# EAGLE design Sensor Board (EAGLE 9.1.1)
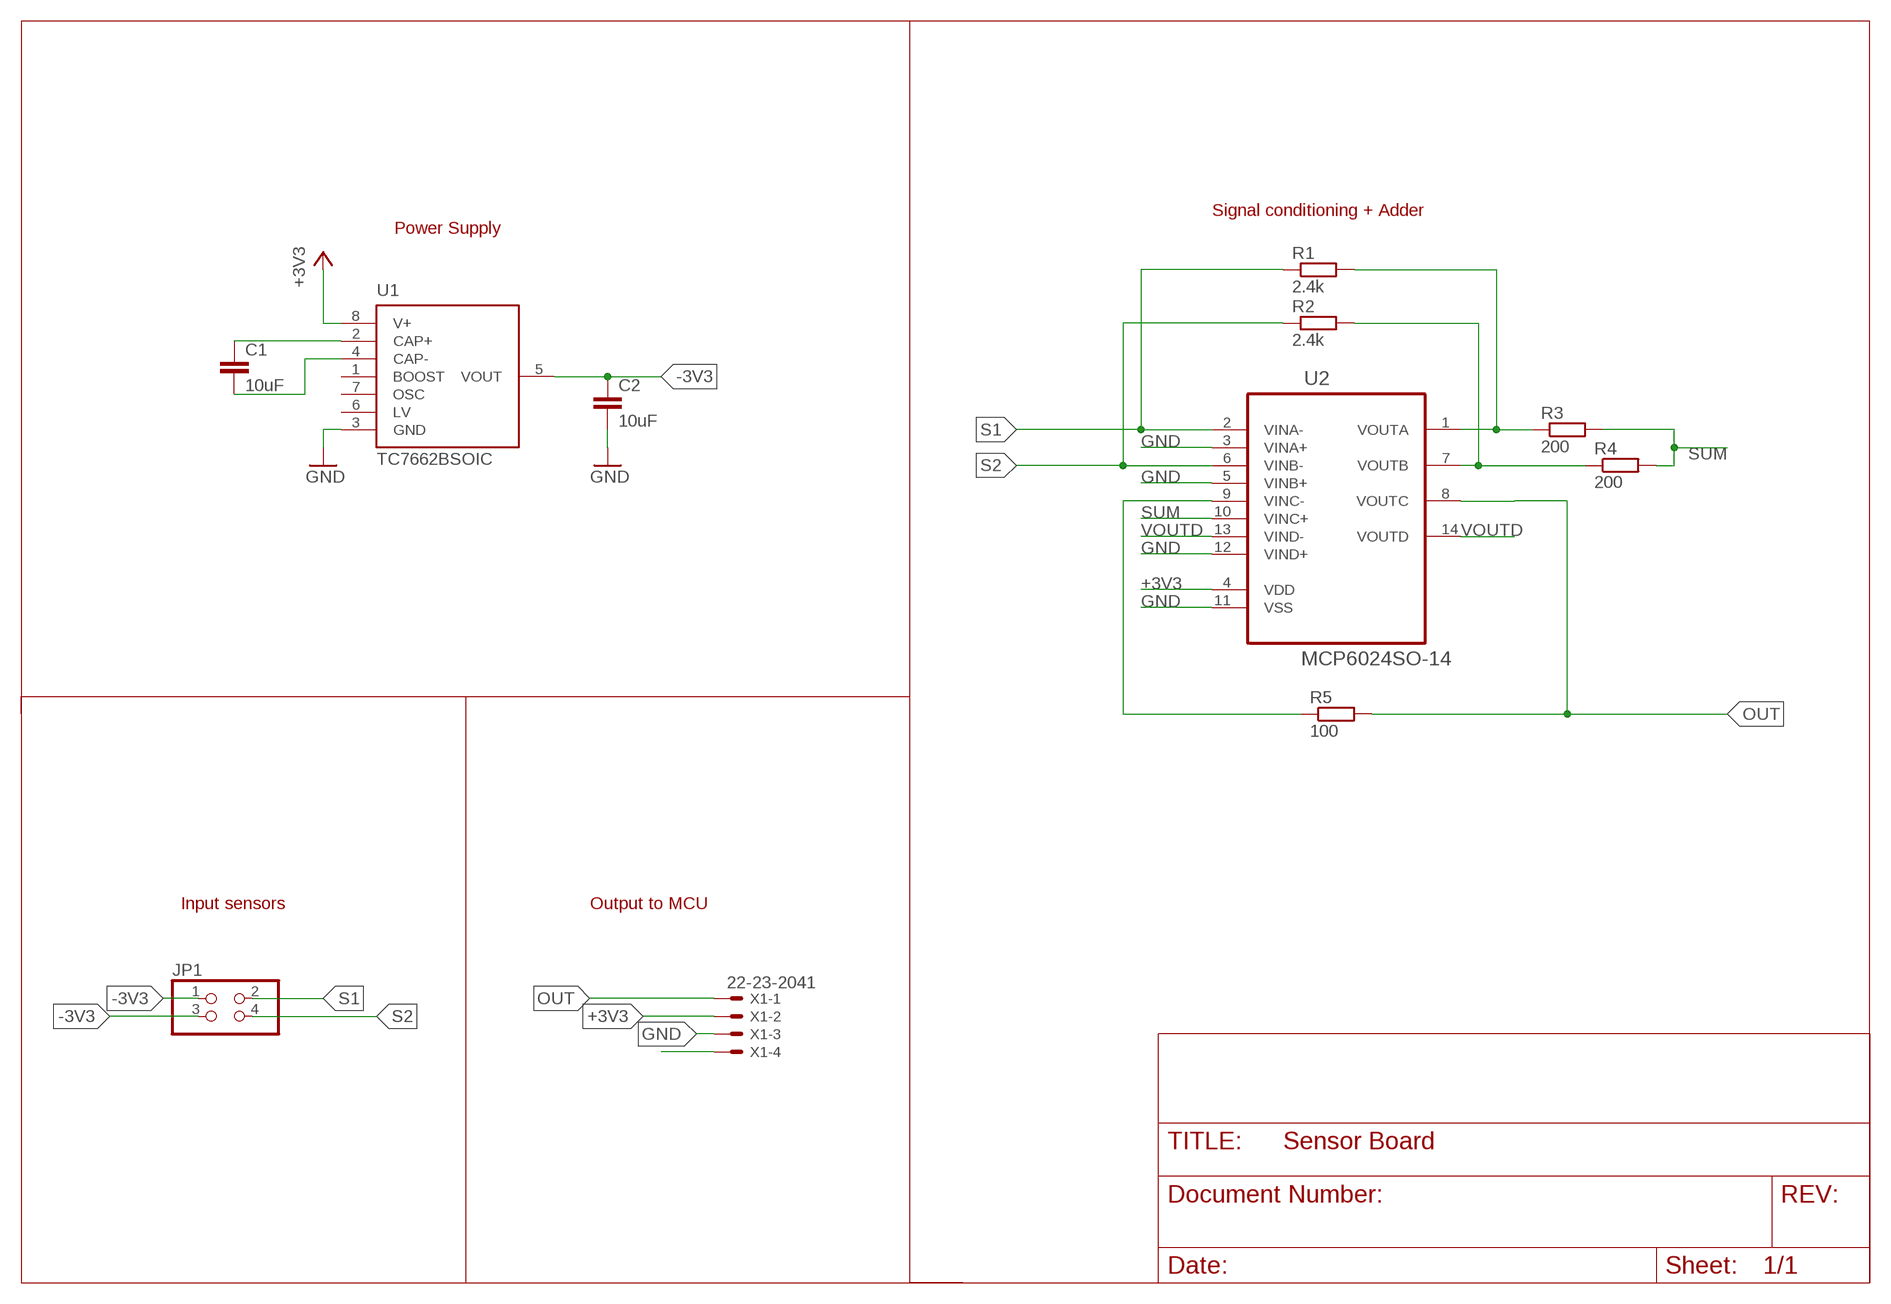
[diagram p0: schematic, sheet 1]

## Parts
C1  10uF  C-EUC0603  [C0603]
C2  10uF  C-EUC0603  [C0603]
JP1  PINHD-2X2/90  [2X02/90]
R1  2.4k  R-EU_R0603  [R0603]
R2  2.4k  R-EU_R0603  [R0603]
R3  200  R-EU_R0603  [R0603]
R4  200  R-EU_R0603  [R0603]
R5  100  R-EU_R0603  [R0603]
U1  TC7662BSOIC  [SO-08]
U2  MCP6024SO-14  [SO-14]
X1  22-23-2041  [22-23-2041]

## Nets
+3V3: U1.8(V+) U2.4(VDD) X1.2
-3V3: C2.1 JP1.1 JP1.3 U1.5(VOUT)
GND: C2.2 U1.3(GND) U2.3(VINA+) U2.5(VINB+) U2.11(VSS) U2.12(VIND+) X1.3
N$1: C1.1 U1.2(CAP+)
N$2: C1.2 U1.4(CAP-)
N$5: R1.2 R3.1 U2.1(VOUTA)
N$7: R2.2 R4.1 U2.7(VOUTB)
N$8: R5.1 U2.9(VINC-)
N$9: X1.4
OUT: R5.2 U2.8(VOUTC) X1.1
S1: JP1.2 R1.1 U2.2(VINA-)
S2: JP1.4 R2.1 U2.6(VINB-)
SUM: R3.2 R4.2 U2.10(VINC+)
VOUTD: U2.13(VIND-) U2.14(VOUTD)
Unconnected: U1.1(BOOST) U1.6(LV) U1.7(OSC)

## Notes on the sheet
- Signal conditioning + Adder
- Power Supply
- Input sensors | Output to MCU

## Library data of the parts
C1 C2 = rcl:C-EU: CAPACITOR, European symbol; SPICEPREFIX: C
JP1 = pinhead:PINHD-2X2: PIN HEADER
R1-R5 = rcl:R-EU_: RESISTOR, European symbol; SPICEPREFIX: R
U1 = microchip2:TC7662B: Charge Pump DC-to-DC Voltage Converter The TC7662B is a pin-compatible upgrade to the Industry standard TC7660 charge pump voltage converter. It converts a +1.5V to +15V input to a corresponding – 1.5 to – 15V output using only two low-cost capacitors, eliminating inductors and their associated cost, size and EMI. The on-board oscillator operates at a nominal frequency of 10kHz. Frequency is increased to 35kHz when pin 1 is connected to V+, allowing the use of smaller external capacitors. Operation below 10kHz (for lower supply current applications) is also possible by connecting an external capacitor from OSC to ground (with pin 1 open). The TC7662B is available in both 8-pin DIP and 8-pin small outline (SO) packages in commercial and extended temperature ranges.; SPICEPREFIX: X
U2 = microchip2:MCP6024: Rail-to-Rail Input/Output, 10 MHz Op Amps The MCP6021, MCP6021R, MCP6022, MCP6023 and MCP6024 from Microchip Technology Inc. are rail-to rail input and output operational amplifiers with high performance. Key specifications include: wide bandwidth (10 MHz), low noise (8.7 nV/Hz), low input offset voltage and low distortion (0.00053% THD+N). The MCP6023 also offers a Chip Select pin (CS) that gives power savings when the part is not in use.
X1 = connector:22-23-2041: .100" (2.54mm) Center Header - 4 Pin; MF: MOLEX; MPN: 22-23-2041; OC_FARNELL: 1462920; OC_NEWARK: 38C0355

## Board
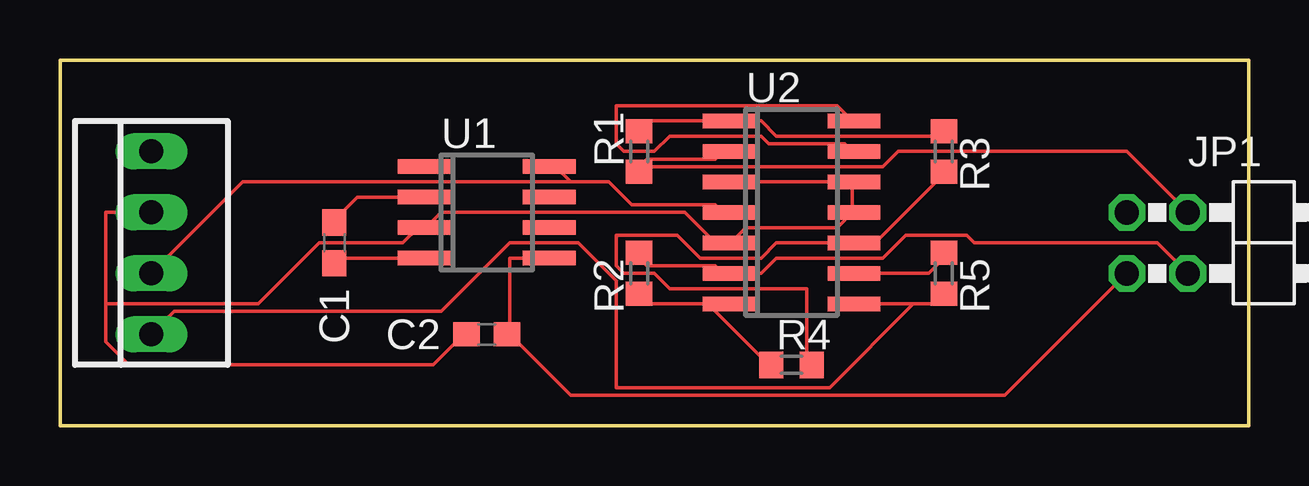
[diagram p1: board, top side]
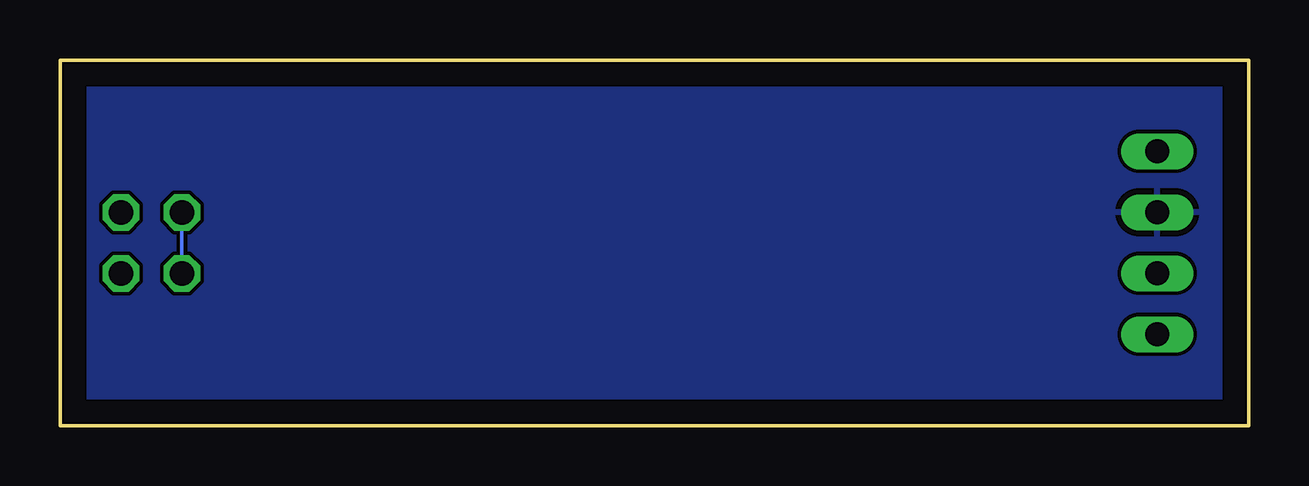
[diagram p2: board, bottom side, seen from below]

Size 49.53 x 15.24 mm. Coordinates in mm from the lower left corner, seen from the top.
Outline: 0,0 0,15.24 49.53,15.24 49.53,0 0,0
Copper layers (1*16): Top 0.035mm / dielectric 1.5mm / Bottom 0.035mm
Design rules "default": minimum track width 6mil, minimum drill 0.35mm, track to track 6mil, track to pad 6mil, pad to pad 6mil, via to via 6mil, smd to smd 6mil, copper to edge 40mil, drill to drill 6mil, minimum pad ring 10mil, minimum via ring 8mil, stop-mask expansion 4mil, vias tented up to drill 0mil, thermal gap 10mil

### Footprints (pad centres in the part's own frame; a part is rotated, then mirrored left to right if it is on the bottom)
C0603 = smd 1.1 x 1: 1 -0.85,0; 2 0.85,0
2X02/90 = drill 1.016 octagon: 1 -1.27,-6.35; 2 -1.27,-3.81; 3 1.27,-6.35; 4 1.27,-3.81
R0603 = smd 1 x 1.1: 1 -0.85,0; 2 0.85,0
SO-08 = smd 0.6 x 2.2: 1 -1.905,-2.6; 2 -0.635,-2.6; 3 0.635,-2.6; 4 1.905,-2.6; 5 1.905,2.6; 6 0.635,2.6; 7 -0.635,2.6; 8 -1.905,2.6
SO-14 = smd 0.6 x 2.2: 1 -3.81,-2.6; 2 -2.54,-2.6; 3 -1.27,-2.6; 4 0,-2.6; 5 1.27,-2.6; 6 2.54,-2.6; 7 3.81,-2.6; 8 3.81,2.6; 9 2.54,2.6; 10 1.27,2.6; 11 0,2.6; 12 -1.27,2.6; 13 -2.54,2.6; 14 -3.81,2.6
22-23-2041 = drill 1 long: 1 -3.81,0; 2 -1.27,0; 3 1.27,0; 4 3.81,0

### Placement (x,y rotation side)
C1  11.43,7.62 270 top
C2  17.78,3.81 180 top
JP1  50.8,7.62 270 top
R1  24.13,11.43 90 top
R2  24.13,6.35 270 top
R3  36.83,11.43 270 top
R4  30.48,2.54 0 top
R5  36.83,6.35 270 top
U1  17.78,8.89 270 top
U2  30.48,8.89 270 top
X1  3.81,7.62 90 top

### Tracks (layer width: path | path; a pad name or v marks a point on that pad's centre or on a via)
+3V3
  Top 0.152: 21.27,10.16 20.64,10.79 U1.8 | 21.27,10.16 22.86,10.16 23.81,9.21 27.3,9.21 27.62,8.89 U2.4 | X1.2 7.62,10.16 21.27,10.16
-3V3
  Top 0.152: 18.73,3.81 18.73,6.99 20.32,6.99 U1.5 | 18.73,3.81 C2.1 18.73,3.81 | 18.73,3.81 21.27,1.27 39.37,1.27 JP1.3
  Bottom 0.152: JP1.1 JP1.3
GND
  Top 0.152: 1.91,5.08 1.91,8.89 X1.3 | 1.91,5.08 1.91,3.49 2.86,2.54 15.56,2.54 16.83,3.81 C2.2 | 33.02,10.16 27.94,10.16 U2.3 | 33.02,10.16 U2.12 33.02,10.16 | 33.02,8.89 32.38,8.26 28.57,8.26 27.94,7.62 U2.5 27.62,7.62 27.3,7.62 26.04,8.89 15.88,8.89 15.24,8.26 U1.3 14.92,8.26 14.29,7.62 10.79,7.62 8.26,5.08 1.91,5.08 | 33.02,8.89 U2.11 33.02,8.89 | 33.02,8.89 33.02,10.16
  pour Bottom: -1.27,16.51 -1.27,-1.27 50.8,-1.27 50.8,16.51
N$1
  Top 0.152: C1.1 11.43,8.57 12.38,9.53 14.92,9.53 U1.2
N$2
  Top 0.152: C1.2 11.43,6.99 14.92,6.99 U1.4
N$5
  Top 0.152: R1.2 24.13,12.38 24.45,12.7 27.62,12.7 U2.1 27.94,12.7 29.21,12.7 29.84,12.06 36.83,12.06 R3.1
N$7
  Top 0.152: 26.99,5.08 27.62,5.08 U2.7 26.99,5.08 | 26.99,5.08 24.45,5.08 24.13,5.4 R2.2 | 26.99,5.08 29.53,2.54 R4.1
N$8
  Top 0.152: R5.1 36.83,6.99 36.2,6.35 33.34,6.35 U2.9
OUT
  Top 0.152: 35.56,5.08 33.34,5.08 U2.8 | 35.56,5.08 36.51,5.08 36.83,5.4 R5.2 | X1.1 4.76,4.76 15.88,4.76 18.73,7.62 21.59,7.62 23.18,6.03 23.18,1.59 32.07,1.59 35.56,5.08
S1
  Top 0.152: 24.13,10.79 24.45,11.11 27.3,11.11 27.62,11.43 U2.2 | 24.13,10.79 R1.1 24.13,10.79 | JP1.2 44.45,11.43 34.92,11.43 34.29,10.79 24.13,10.79
S2
  Top 0.152: R2.1 24.13,6.99 24.45,6.67 27.3,6.67 27.62,6.35 U2.6 27.94,6.35 29.21,6.35 29.84,6.99 34.29,6.99 35.24,7.94 37.78,7.94 38.1,7.62 45.72,7.62 JP1.4
SUM
  Top 0.152: R4.2 31.11,2.54 31.11,5.71 25.4,5.71 24.77,6.35 23.5,6.35 23.18,6.67 23.18,7.94 25.72,7.94 26.67,6.99 29.21,6.99 29.84,7.62 33.02,7.62 U2.10 33.34,7.62 33.97,7.62 36.83,10.48 R3.2
VOUTD
  Top 0.152: U2.13 33.02,11.43 32.7,11.75 29.53,11.75 29.21,12.06 25.4,12.06 24.77,11.43 23.5,11.43 23.18,11.75 23.18,13.34 32.38,13.34 33.02,12.7 U2.14